# EAGLE design ospi150 (EAGLE 7.7.0)
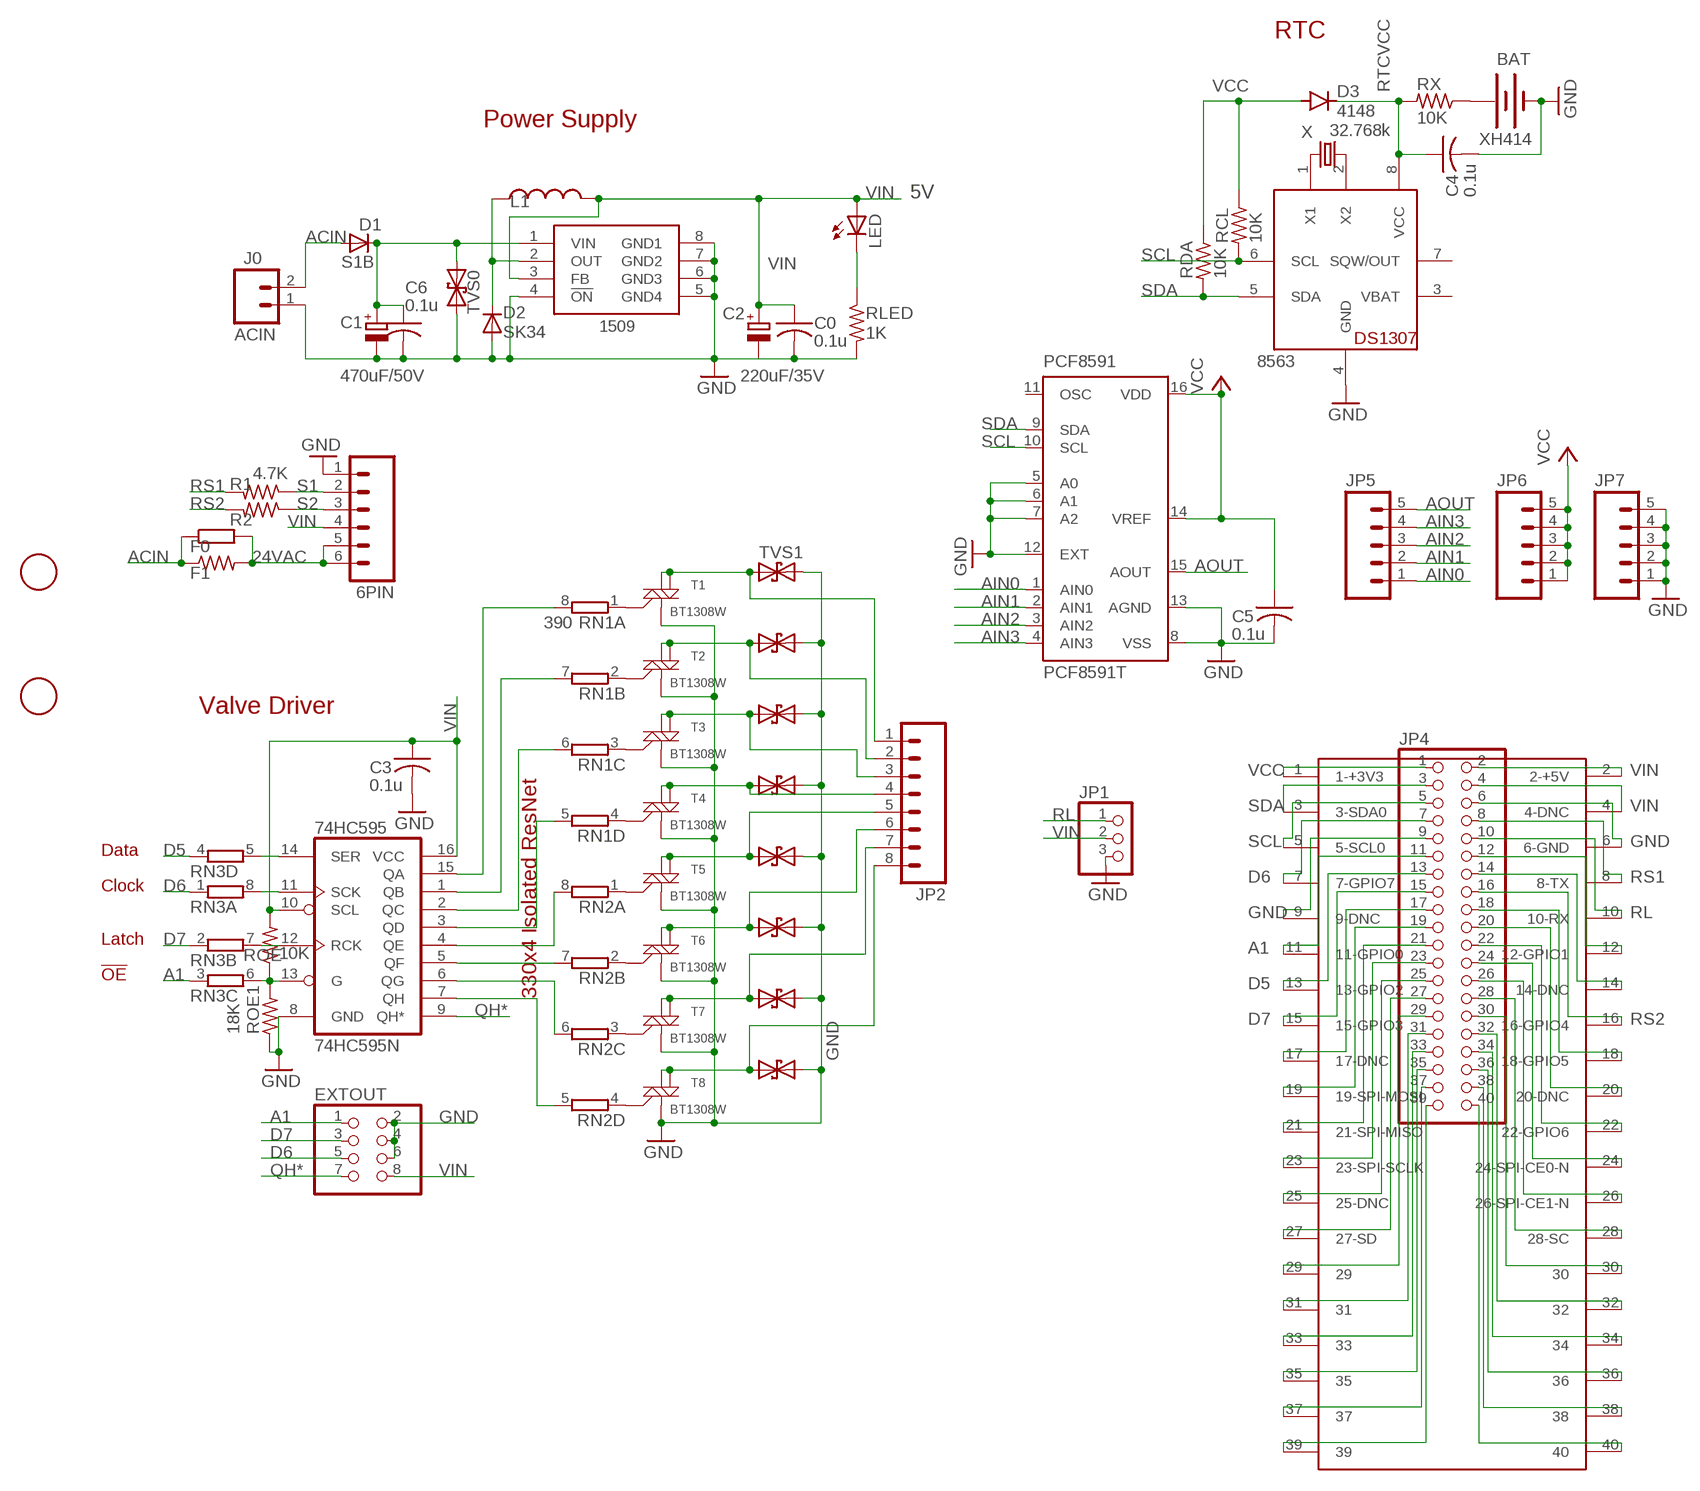
[diagram p0: schematic, sheet 1]

## Parts
1F  FIDUCIAL  [FIDUCIAL_1MM]
2F  FIDUCIAL  [FIDUCIAL_1MM]
6PIN  M065MM  [SCREWTERMINAL-5MM-6]
74HC595  74HC595N  74LS595D  [SO16]
1509  XL1509  [SO08]
8563  PCF8563  DS1307SOIC  [SO08]
BAT  XH414  BATTERYXH414  [BATTCON_XH414]
C0  0.1u  C-USC0603K  [C0603K]
C1  470uF/50V  CPOL-EUE5-10.5  [E5-10,5]
C2  220uF/35V  CPOL-EUE3.5-8  [E3,5-8]
C3  0.1u  C-USC0603K  [C0603K]
C4  0.1u  C-USC0603K  [C0603K]
C5  0.1u  C-USC0603K  [C0603K]
C6  0.1u  C-USC0603K  [C0603K]
D1  S1B  DIODE-DO-214AC  [DO-214AC]
D2  SK34  DIODE-SMB  [SMB]
D3  4148  DIODE-MINIMELF  [MINIMELF]
EXTOUT  PINHD-2X4/90  [2X04/90]
F0  R-EU_0207/15  [0207/15]
F1  R-US_R1206  [R1206]
J0  ACIN  M024MM-X  [SCREWTERMINAL-4MM-2-X]
JP1  PINHD-1X3  [1X03]
JP2  M085MM-8  [SCREWTERMINAL-5MM-8]
JP4  PINHD-2X20  [2X20]
JP5  M05PTH  [1X05]
JP6  M05PTH  [1X05]
JP7  M05PTH  [1X05]
L1  150uH  INDUCTORPWR  [CDRH125]
LED  LEDCHIPLED_0805  [CHIPLED_0805]
PCF8591  PCF8591T  [SO16W]
R1  4.7K  R-US_R0603  [R0603]
R2  4.7K  R-US_R0603  [R0603]
RCL  10K  R-US_R0603  [R0603]
RDA  10K  R-US_R0603  [R0603]
RLED  1K  R-US_R0603  [R0603]
RN1  390  4R-NEXB38V  [EXB38V]
RN2  390  4R-NEXB38V  [EXB38V]
RN3  390  4R-NEXB38V  [EXB38V]
ROE  10K  R-US_R0603  [R0603]
ROE1  18K  R-US_R0603  [R0603]
RX  10K  R-US_R0603  [R0603]
T1  BT1308W  MAC97SOT223  [SOT223]
T2  BT1308W  MAC97SOT223  [SOT223]
T3  BT1308W  MAC97SOT223  [SOT223]
T4  BT1308W  MAC97SOT223  [SOT223]
T5  BT1308W  MAC97SOT223  [SOT223]
T6  BT1308W  MAC97SOT223  [SOT223]
T7  BT1308W  MAC97SOT223  [SOT223]
T8  BT1308W  MAC97SOT223  [SOT223]
TVS0  TVSSMB  [SMB]
TVS1  TVSSMB  [SMB]
TVS2  TVSSMB  [SMB]
TVS3  TVSSMB  [SMB]
TVS4  TVSSMB  [SMB]
TVS5  TVSSMB  [SMB]
TVS6  TVSSMB  [SMB]
TVS7  TVSSMB  [SMB]
TVS8  TVSSMB  [SMB]
U$2  RPIB+B+  [RPIB+]
X  32.768k  CRYSTALMM20SS1  [MM20SS1]

## Nets
24VAC [power]: 6PIN.5 6PIN.6 F0.2 F1.2
A1: EXTOUT.1 JP4.11 RN3.3 U$2.11(11-GPIO0)
ACIN [power]: D1.A F0.1 F1.1 J0.2
AIN0: JP5.1 PCF8591.1(AIN0)
AIN1: JP5.2 PCF8591.2(AIN1)
AIN2: JP5.3 PCF8591.3(AIN2)
AIN3: JP5.4 PCF8591.4(AIN3)
AOUT: JP5.5 PCF8591.15(AOUT)
D5: JP4.13 RN3.4 U$2.13(13-GPIO2)
D6: EXTOUT.5 JP4.7 RN3.1 U$2.7(7-GPIO7)
D7: EXTOUT.3 JP4.15 RN3.2 U$2.15(15-GPIO3)
GND [power]: 6PIN.1 74HC595.8(GND) 1509.4(!ON) 1509.5(GND4) 1509.6(GND3) 1509.7(GND2) 1509.8(GND1) 8563.4(GND) BAT.P$1(-) C0.2 C1.- C2.- C3.2 C4.2 C5.2 C6.2 D2.A EXTOUT.2 EXTOUT.4 EXTOUT.6 J0.1 JP1.3 JP4.6 JP4.9 JP7.1 JP7.2 JP7.3 JP7.4 JP7.5 PCF8591.5(A0) PCF8591.6(A1) PCF8591.7(A2) PCF8591.8(VSS) PCF8591.12(EXT) PCF8591.13(AGND) RLED.2 ROE1.1 T1.1(M1) T2.1(M1) T3.1(M1) T4.1(M1) T5.1(M1) T6.1(M1) T7.1(M1) T8.1(M1) TVS0.A TVS1.C TVS2.C TVS3.C TVS4.C TVS5.C TVS6.C TVS7.C TVS8.C U$2.6(6-GND) U$2.9(9-DNC)
N$1: LED.C RLED.1
N$2 [power]: 1509.1(VIN) C1.+ C6.1 D1.C TVS0.C
N$3: RN1.1 T1.3(G)
N$4: 74HC595.5(QF) RN2.7
N$5: 74HC595.6(QG) RN2.6
N$6: RN1.2 T2.3(G)
N$7: 74HC595.7(QH) RN2.5
N$8 [power]: JP2.2 T2.2(M2) T2.4(M2-4) TVS2.A
N$9: 8563.2(X2) X.4
N$10: 74HC595.4(QE) RN2.8
N$11: 74HC595.3(QD) RN1.5
N$12: 74HC595.2(QC) RN1.6
N$13: 74HC595.1(QB) RN1.7
N$14: 74HC595.15(QA) RN1.8
N$15: RN1.3 T3.3(G)
N$16 [power]: JP2.1 T1.2(M2) T1.4(M2-4) TVS1.A
N$18 [power]: JP2.3 T3.2(M2) T3.4(M2-4) TVS3.A
N$19: RN1.4 T4.3(G)
N$20 [power]: JP2.4 T4.2(M2) T4.4(M2-4) TVS4.A
N$21: RN2.1 T5.3(G)
N$22 [power]: JP2.5 T5.2(M2) T5.4(M2-4) TVS5.A
N$23 [power]: JP2.6 T6.2(M2) T6.4(M2-4) TVS6.A
N$25 [power]: JP2.7 T7.2(M2) T7.4(M2-4) TVS7.A
N$26: RN2.2 T6.3(G)
N$27: RN2.3 T7.3(G)
N$28: RN2.4 T8.3(G)
N$30: 8563.1(X1) X.1
N$32: BAT.P$2(+) RX.1
N$33: 74HC595.14(SER) RN3.5
N$34: 74HC595.11(SCK) RN3.8
N$35: 74HC595.12(RCK) RN3.7
N$36: 1509.2(OUT) D2.C L1.1
N$37: JP4.12 U$2.12(12-GPIO1)
N$38: JP4.14 U$2.14(14-DNC)
N$40: 74HC595.13(G) RN3.6 ROE1.2 ROE.1
N$41: JP4.23 U$2.23(23-SPI-SCLK)
N$42: JP4.25 U$2.25(25-DNC)
N$43: JP4.27 U$2.27(27-SD)
N$44: JP4.29 U$2.29
N$45: JP4.39 U$2.39
N$46: JP4.37 U$2.37
N$47: JP4.17 U$2.17(17-DNC)
N$48: JP4.19 U$2.19(19-SPI-MOSI)
N$49: JP4.21 U$2.21(21-SPI-MISO)
N$50: JP4.35 U$2.35
N$51: JP4.33 U$2.33
N$52: JP4.31 U$2.31
N$53: JP4.34 U$2.34
N$54: JP4.36 U$2.36
N$55: JP4.38 U$2.38
N$56: JP4.40 U$2.40
N$57 [power]: JP2.8 T8.2(M2) T8.4(M2-4) TVS8.A
N$59: JP4.18 U$2.18(18-GPIO5)
N$60: JP4.20 U$2.20(20-DNC)
N$61: JP4.22 U$2.22(22-GPIO6)
N$62: JP4.24 U$2.24(24-SPI-CE0-N)
N$63: JP4.26 U$2.26(26-SPI-CE1-N)
N$64: JP4.28 U$2.28(28-SC)
N$65: JP4.30 U$2.30
N$66: JP4.32 U$2.32
QH*: 74HC595.9(QH*) EXTOUT.7
RL: JP1.1 JP4.10 U$2.10(10-RX)
RS1: JP4.8 R1.2 U$2.8(8-TX)
RS2: JP4.16 R2.2 U$2.16(16-GPIO4)
RTCVCC [power]: 8563.8(VCC) C4.1 D3.C RX.2
S1: 6PIN.2 R1.1
S2: 6PIN.3 R2.1
SCL [i2c]: 8563.6(SCL) JP4.5 PCF8591.10(SCL) RCL.2 U$2.5(5-SCL0)
SDA [i2c]: 8563.5(SDA) JP4.3 PCF8591.9(SDA) RDA.2 U$2.3(3-SDA0)
VCC: C5.1 D3.A JP4.1 JP6.1 JP6.2 JP6.3 JP6.4 JP6.5 PCF8591.14(VREF) PCF8591.16(VDD) RCL.1 RDA.1 U$2.1(1-+3V3)
VIN [power]: 6PIN.4 74HC595.10(SCL) 74HC595.16(VCC) 1509.3(FB) C0.1 C2.+ C3.1 EXTOUT.8 JP1.2 JP4.2 JP4.4 L1.2 LED.A ROE.2 U$2.2(2-+5V) U$2.4(4-DNC)
Unconnected: 8563.7(SQW/OUT) PCF8591.11(OSC)

## Notes on the sheet
- RTC
- Power Supply
- 5V
- Valve Driver
- Data
- Clock
- Latch
- !OE
- 330x4 Isolated ResNet

## Power pins joined to a net without a drawn wire
VBAT: 8563.3(VBAT)

## Library data of the parts
1F 2F = adafruitGood:FIDUCIAL: For use by pick and place machines to calibrate the vision/machine, 1mm By microbuilder.eu
6PIN = SparkFun:M06: Header 6 Standard 6-pin 0.1" header. Use with straight break away headers (SKU : PRT-00116), right angle break away headers (PRT-00553), swiss pins (PRT-00743), machine pins (PRT-00117), and female headers (PRT-00115). Molex polarized connector foot print use with SKU : PRT-08094 with associated crimp pins and housings. NOTES ON THE VARIANTS LOCK and LOCK_LONGPADS... This footprint was designed to help hold the alignment of a through-hole component (i.e. 6-pin header) while soldering it into place. You may notice that each hole has been shifted either up or down by 0.005 of an inch from it's more standard position (which is a perfectly straight line). This slight alteration caused the pins (the squares in the middle) to touch the edges of the holes. Because they are alternating, it causes a "brace" to hold the component in place. 0.005 has proven to be the perfect amount of "off-center" position when using our standard breakaway headers. Although looks a little odd when you look at the bare footprint, once you have a header in there, the alteration is very hard to notice. Also, if you push a header all the way into place, it is covered up entirely on the bottom side. This idea of altering the position of holes to aid alignment will be further integrated into the Sparkfun Library for other footprints. It can help hold any component with 3 or more connection pins.
74HC595 = SparkFun:74*595: 8-bit SHIFT REGISTER, output latch
1509 = adafruit:XL1509
8563 = adafruit:DS1307: DS1307 Real time clock (RTC) with battery backup ability. Talk to it via i2c
BAT = SparkFunNew:BATTERY: Battery Holders Various common sizes : AA, AAA, 20mm coin cell and 12mm coin cell.
C0 C3-C6 = adafruit:C-US: CAPACITOR, American symbol
C1 C2 = resistor:CPOL-EU: POLARIZED CAPACITOR, European symbol
D1 D2 = diode:DIODE-: DIODE
D3 = diode@1:DIODE-: DIODE
EXTOUT = pinhead:PINHD-2X4: PIN HEADER
F0 = rcl:R-EU_: RESISTOR, European symbol; SPICEPREFIX: R
F1 = adafruit:R-US_: RESISTOR, American symbol
J0 = SparkFun:M02: Header 2 Standard 2-pin 0.1" header. Use with straight break away headers (SKU : PRT-00116), right angle break away headers (PRT-00553), swiss pins (PRT-00743), machine pins (PRT-00117), and female headers (PRT-00115). Molex polarized connector foot print use with SKU : PRT-08233 with associated crimp pins and housings.
JP1 = pinhead:PINHD-1X3: PIN HEADER
JP2 = SparkFun:M08: Header 8 Standard 8-pin 0.1" header. Use with straight break away headers (SKU : PRT-00116), right angle break away headers (PRT-00553), swiss pins (PRT-00743), machine pins (PRT-00117), and female headers (PRT-00115).
JP4 = adafruit_3:PINHD-2X20: PIN HEADER
JP5-JP7 = SparkFun:M05: Header 5 Standard 5-pin 0.1" header. Use with straight break away headers (SKU : PRT-00116), right angle break away headers (PRT-00553), swiss pins (PRT-00743), machine pins (PRT-00117), and female headers (PRT-00115). Molex polarized connector foot print use with SKU : PRT-08230 with associated crimp pins and housings.
L1 = SparkFunNew:INDUCTOR: Inductors Basic Inductor/Choke - 0603 and 1206. Footprints are not proven and vary greatly between part numbers.
LED = adafruit:LED: LED OSRAM: - CHIPLED LG R971, LG N971, LY N971, LG Q971, LY Q971, LO R971, LY R971 LH N974, LH R974 LS Q976, LO Q976, LY Q976 LO Q996 - Hyper CHIPLED LW Q18S LB Q993, LB Q99A, LB R99A - SideLED LS A670, LO A670, LY A670, LG A670, LP A670 LB A673, LV A673, LT A673, LW A673 LH A674 LY A675 LS A676, LA A676, LO A676, LY A676, LW A676 LS A679, LY A679, LG A679 - Hyper Micro SIDELED® LS Y876, LA Y876, LO Y876, LY Y876 LT Y87S - SmartLED LW L88C, LW L88S LB L89C, LB L89S, LG L890 LS L89K, LO L89K, LY L89K LS L896, LA L896, LO L896, LY L896 - TOPLED LS T670, LO T670, LY T670, LG T670, LP T670 LSG T670, LSP T670, LSY T670, LOP T670, LYG T670 LG T671, LOG T671, LSG T671 LB T673, LV T673, LT T673, LW T673 LH T674 LS T676, LA T676, LO T676, LY T676, LB T676, LH T676, LSB T676, LW T676 LB T67C, LV T67C, LT T67C, LS T67K, LO T67K, LY T67K, LW E67C LS E67B, LA E67B, LO E67B, LY E67B, LB E67C, LV E67C, LT E67C LW T67C LS T679, LY T679, LG T679 LS T770, LO T770, LY T770, LG T770, LP T770 LB T773, LV T773, LT T773, LW T773 LH T774 LS E675, LA E675, LY E675, LS T675 LS T776, LA T776, LO T776, LY T776, LB T776 LHGB T686 LT T68C, LB T68C - Hyper Mini TOPLED® LB M676 - Mini TOPLED Santana® LG M470 LS M47K, LO M47K, LY M47K Source: http://www.osram.convergy.de/
PCF8591 = micro-philips:PCF8591: I2C-Bus D/A CONVERTER; MPN: PCF8591T/2,512; OC_FARNELL: 1826767; OC_NEWARK: 70R6911
R1 R2 RCL RDA RLED ROE ROE1 RX = adafruit2013:R-US_: RESISTOR, American symbol
RN1-RN3 = resistor-dil:4R-N: Array Chip Resistor Source: RS Component / Phycomp; OC_FARNELL: unknown; OC_NEWARK: unknown
T1-T8 = SparkFun:MAC97: MAC97 Triac http://www.onsemi.com/pub_link/Collateral/MAC97-D.PDF
TVS0 TVS1-TVS8 = SparkFunNew:TVS
U$2 = RaspberryPi:RPIB+
X = crystal:CRYSTAL: CRYSTAL

## Net classes
0 default: width 0.178 mm, clearance 0.178 mm
1 power: width 0.254 mm, clearance 0.203 mm
2 relay power: width 0.508 mm, clearance 0.254 mm
3 i2c: width 0.254 mm, clearance 0.203 mm

## Board
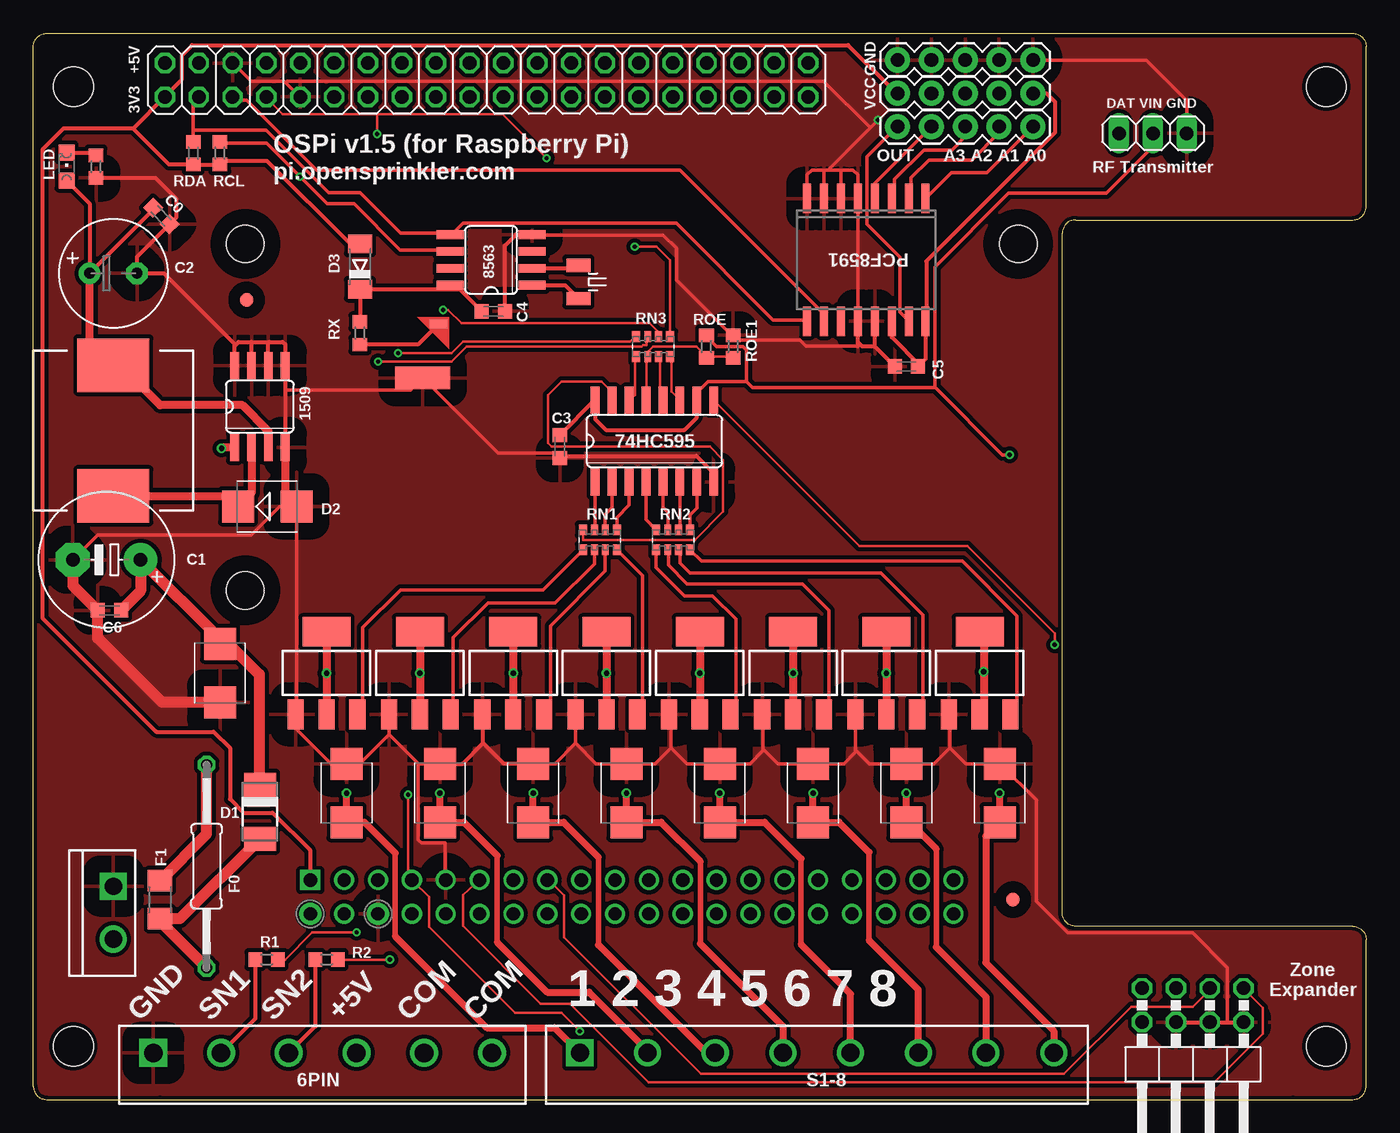
[diagram p1: board, top side]
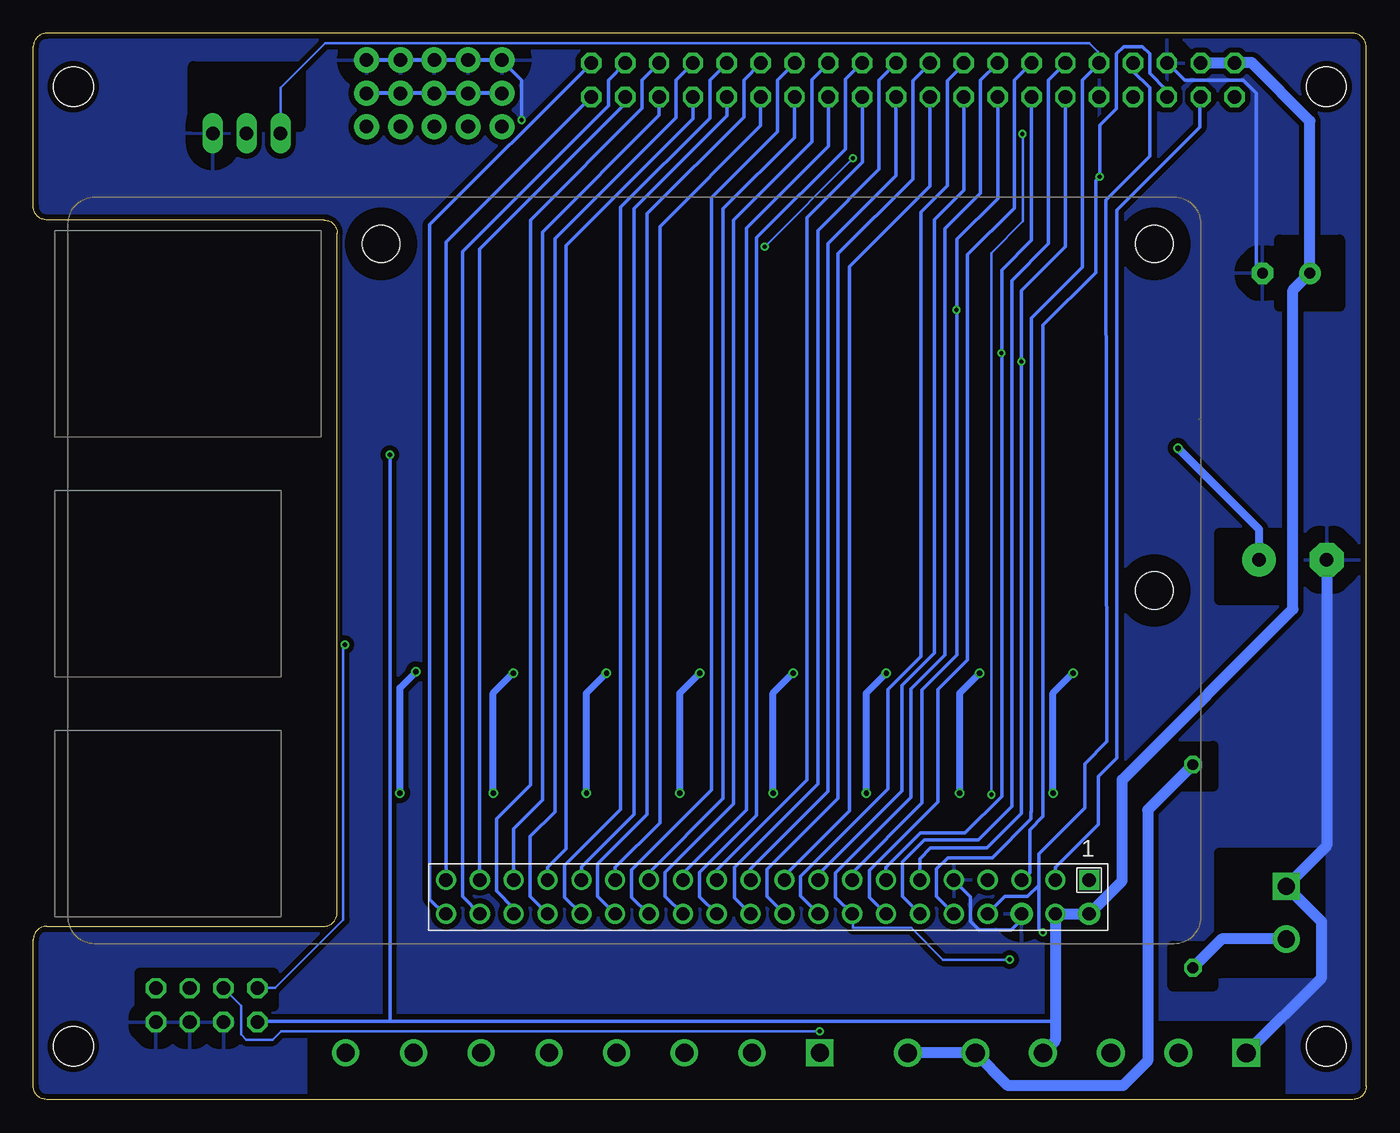
[diagram p2: board, bottom side, seen from below]

Size 100 x 80 mm. Coordinates in mm from the lower left corner, seen from the top.
Outline: 9.5,0 94.5,0 99,0 arc90 100,1 100,12 arc90 99,13 78.2,13 arc-90 77.2,14 77.2,65 arc-90 78.2,66 99,66 arc90 100,67 100,79 arc90 99,80 1,80 arc90 0,79 0,1 arc90 1,0 9.5,0
Copper layers (1*16): Top 0.035mm / dielectric 1.5mm / Bottom 0.035mm
Design rules "Fusion_eagle_rule_v1.1 *": minimum track width 6mil, minimum drill 12mil, track to track 6mil, track to pad 6mil, pad to pad 6mil, via to via 6mil, smd to smd 0mil, copper to edge 10mil, drill to drill 10mil, minimum pad ring 10mil, minimum via ring 6mil, stop-mask expansion 2mil, vias tented up to drill 100mil, thermal gap 50mil
Holes 3 mm at 3,76 97,76 3,4 97,4
tRestrict: area 71.6,61.9 to 76.2,66.5; area 13.6,61.9 to 18.2,66.5; area 13.6,35.9 to 18.2,40.5
bRestrict: area 13.6,61.9 to 18.2,66.5; area 71.6,61.9 to 76.2,66.5; area 2,59.5 to 6.5,64.5; area 5.5,37.5 to 11,42.5; area 3.5,9.5 to 11,18.5; area 11.5,23.5 to 14.5,26.5; area 11.5,8.5 to 14.5,11.5; area 6.5,0.5 to 79,5.5; area 80,73 to 88,77.5; area 82,7 to 92,9.5; area 13.6,35.9 to 18.2,40.5

### Footprints (pad centres in the part's own frame; a part is rotated, then mirrored left to right if it is on the bottom)
FIDUCIAL_1MM = smd 1 x 1: 1 0,0
SCREWTERMINAL-5MM-6 = drill 1.4 pad 2.032 square: 1 0,0 | drill 1.4 pad 2.032: 2 5.08,0; 3 10.16,0; 4 15.24,0; 5 20.32,0; 6 25.4,0
SO16 = smd 0.66 x 2.032: 1 -4.445,-3.073; 2 -3.175,-3.073; 3 -1.905,-3.073; 4 -0.635,-3.073; 5 0.635,-3.073; 6 1.905,-3.073; 7 3.175,-3.073; 8 4.445,-3.073; 9 4.445,3.073; 10 3.175,3.073; 11 1.905,3.073; 12 0.635,3.073; 13 -0.635,3.073; 14 -1.905,3.073; 15 -3.175,3.073; 16 -4.445,3.073
SO08 = smd 0.66 x 2.032: 1 -1.905,-3.073; 2 -0.635,-3.073; 3 0.635,-3.073; 4 1.905,-3.073; 5 1.905,3.073; 6 0.635,3.073; 7 -0.635,3.073; 8 -1.905,3.073
BATTCON_XH414 = smd 4.1 x 1.7: P$1 0.7,-1.85 | smd 1.27 x 0.635: P$2 1.9,2.2
C0603K = smd 1.05 x 1.08: 1 -0.875,0; 2 0.875,0
E5-10,5 = drill 1.016 pad 2.54: + -2.54,0 | drill 1.016 pad 2.54 octagon: - 2.54,0
E3,5-8 = drill 0.813 pad 1.6: + -1.778,0 | drill 0.813 pad 1.6 octagon: - 1.778,0
DO-214AC = smd 1.8 x 2.4: A 2.025,0; C -2.025,0
SMB = smd 2.4 x 2.4: A 2.2,0; C -2.2,0
MINIMELF = smd 1.4 x 1.8: A 1.7,0; C -1.7,0
2X04/90 = drill 1.016 octagon: 1 -3.81,-6.35; 2 -3.81,-3.81; 3 -1.27,-6.35; 4 -1.27,-3.81; 5 1.27,-6.35; 6 1.27,-3.81; 7 3.81,-6.35; 8 3.81,-3.81
0207/15 = drill 0.813 octagon: 1 -7.62,0; 2 7.62,0
R1206 = smd 1.6 x 1.803: 1 -1.422,0; 2 1.422,0
SCREWTERMINAL-4MM-2-X = drill 1.3 pad 2.032 square: 1 0,0 | drill 1.3 pad 2.032: 2 3.96,0
1X03 = drill 1.016 long: 1 -2.54,0; 2 0,0; 3 2.54,0
SCREWTERMINAL-5MM-8 = drill 1.35 pad 2.032 square: 1 0,0 | drill 1.35 pad 2.032: 2 5.08,0; 3 10.16,0; 4 15.24,0; 5 20.32,0; 6 25.4,0; 7 30.48,0; 8 35.56,0
2X20 = drill 1.016 octagon: 1 -24.13,-1.27; 2 -24.13,1.27; 3 -21.59,-1.27; 4 -21.59,1.27; 5 -19.05,-1.27; 6 -19.05,1.27; 7 -16.51,-1.27; 8 -16.51,1.27; 9 -13.97,-1.27; 10 -13.97,1.27; 11 -11.43,-1.27; 12 -11.43,1.27; 13 -8.89,-1.27; 14 -8.89,1.27; 15 -6.35,-1.27; 16 -6.35,1.27; 17 -3.81,-1.27; 18 -3.81,1.27; 19 -1.27,-1.27; 20 -1.27,1.27; 21 1.27,-1.27; 22 1.27,1.27; 23 3.81,-1.27; 24 3.81,1.27; 25 6.35,-1.27; 26 6.35,1.27; 27 8.89,-1.27; 28 8.89,1.27; 29 11.43,-1.27; 30 11.43,1.27; 31 13.97,-1.27; 32 13.97,1.27; 33 16.51,-1.27; 34 16.51,1.27; 35 19.05,-1.27; 36 19.05,1.27; 37 21.59,-1.27; 38 21.59,1.27; 39 24.13,-1.27; 40 24.13,1.27
1X05 = drill 1.016 pad 1.88: 1 0,0; 2 2.54,0; 3 5.08,0; 4 7.62,0; 5 10.16,0
CDRH125 = smd 5.4 x 4: 1 0,4.9; 2 0,-4.9
CHIPLED_0805 = smd 1.2 x 1.2: A 0,-1.05; C 0,1.05
SO16W = smd 0.6 x 2.2: 1 -4.445,-4.6; 2 -3.175,-4.6; 3 -1.905,-4.6; 4 -0.635,-4.6; 5 0.635,-4.6; 6 1.905,-4.6; 7 3.175,-4.6; 8 4.445,-4.6; 9 4.445,4.6; 10 3.175,4.6; 11 1.905,4.6; 12 0.635,4.6; 13 -0.635,4.6; 14 -1.905,4.6; 15 -3.175,4.6; 16 -4.445,4.6
R0603 = smd 1 x 1.1: 1 -0.85,0; 2 0.85,0
EXB38V = smd 0.6 x 0.8: 1 -1.275,-0.75; 4 1.275,-0.75; 5 1.275,0.75; 8 -1.275,0.75 | smd 0.5 x 0.8: 2 -0.4,-0.75; 3 0.4,-0.75; 6 0.4,0.75; 7 -0.4,0.75
SOT223 = smd 1.219 x 2.235: 1 -2.311,-3.099; 2 0,-3.099; 3 2.311,-3.099 | smd 3.6 x 2.2: 4 0,3.099
RPIB+ = drill 1 square: 1 8.382,51.232 | drill 1 pad 1.676: 2 8.382,53.772; 6 13.462,53.772 | drill 1: 3 10.922,51.232; 4 10.922,53.772; 5 13.462,51.232; 7 16.002,51.232; 8 16.002,53.772; 9 18.542,51.232; 10 18.542,53.772; 11 21.082,51.232; 12 21.082,53.772; 13 23.622,51.232; 14 23.622,53.772; 15 26.162,51.232; 16 26.162,53.772; 17 28.702,51.232; 18 28.702,53.772; 19 31.242,51.232; 20 31.242,53.772; 21 33.782,51.232; 22 33.782,53.772; 23 36.322,51.232; 24 36.322,53.772; 25 38.862,51.232; 26 38.862,53.772; 27 41.402,51.232; 28 41.402,53.772; 29 43.942,51.232; 30 43.942,53.772; 31 46.482,51.232; 32 46.482,53.772; 33 49.022,51.232; 34 49.022,53.772; 35 51.562,51.232; 36 51.562,53.772; 37 54.102,51.232; 38 54.102,53.772; 39 56.642,51.232; 40 56.642,53.772 | hole 2.8: 3.5,3.5; 61.5,3.5; 3.5,29.5
MM20SS1 = smd 1.8 x 1: 1 0,-1.25; 4 0,1.25

### Placement (x,y rotation side)
1F  16,60 0 top
2F  73.5,15 0 top
6PIN  9,3.5 0 top
74HC595  46.6,49.4 0 top
1509  17,52 0 top
8563  34.35,63 90 top
BAT  28.5,56 0 top
C0  9.6,66.3 315 top
C1  5.5,40.5 180 top
C2  6,62 0 top
C3  39.5,49 270 top
C4  34.5,59.15 0 top
C5  65.5,55 180 top
C6  5.7,36.7 180 top
D1  17,21.6 270 top
D2  17.55,44.5 0 top
D3  24.5,62.5 90 top
EXTOUT  87,2 180 top
F0  13,17.5 90 top
F1  9.5,15 90 top
J0  6,16 270 top
JP1  84,72.5 0 top
JP2  41,3.5 0 top
JP4  34,76.5 0 top
JP5  75,73 180 top
JP6  75,75.5 180 top
JP7  75,78 180 top
L1  6,50.2 180 top
LED  2.5,70 0 top
PCF8591  62.5,63 180 top
R1  17.5,10.5 0 top
R2  22,10.5 0 top
RCL  14,71 90 top
RDA  12,71 90 top
RLED  4.7,70 270 top
RN1  42.5,42 0 top
RN2  48,42 0 top
RN3  46.5,56.5 180 top
ROE  50.5,56.5 90 top
ROE1  52.5,56.5 270 top
RX  24.5,57.5 90 top
T1  22,32 0 top
T2  29,32 0 top
T3  36,32 0 top
T4  43,32 0 top
T5  50,32 0 top
T6  57,32 0 top
T7  64,32 0 top
T8  71,32 0 top
TVS0  14,32 270 top
TVS1  23.5,23 270 top
TVS2  30.5,23 270 top
TVS3  37.5,23 270 top
TVS4  44.5,23 270 top
TVS5  51.5,23 270 top
TVS6  58.5,23 270 top
TVS7  65.5,23 270 top
TVS8  72.5,23 270 top
U$2  12.4,67.7 180 bottom
X  40.9,61.35 0 top

### Tracks (layer width: path | path; a pad name or v marks a point on that pad's centre or on a via)
24VAC
  Top 0.813: F1.2 13,19.92 F0.2
  Bottom 0.813: 6PIN.6 6PIN.5 26.87,1.05 18.25,1.05 16.4,2.9 16.4,21.72 F0.2
A1  (via drill 0.3)
  Top 0.178: v25.88,55.38 31.38,55.38 32.5,56.5 45.62,56.5 45.75,56.62 46,56.62 46,57.25 RN3.3 | EXTOUT.1 90.88,8.25 92.25,6.88 92.25,4.95 88.6,1.3 46.15,1.3 40.25,7.2 38.05,7.2 32.23,13.03 32.23,15.37 U$2.11
  Bottom 0.178: v25.88,55.38 25.87,55.38
  Bottom 0.254: JP4.11 22.57,63.98 25.87,60.68 25.87,55.38 25.87,21.47 28.47,18.87 32.68,18.87 33.48,18.07 U$2.11
ACIN
  Top 0.813: F0.1 9.5,13.38 F1.1 11,13.58 D1.A
  Bottom 0.813: J0.2 10.84,12.04 F0.1
AIN0
  Top 0.254: PCF8591.1 68.89,69.55 71.55,69.55 JP5.1
AIN1
  Top 0.254: PCF8591.2 65.85,67.78 65.85,69.15 67.2,70.5 70.4,70.5 72.46,72.56 JP5.2
AIN2
  Top 0.254: PCF8591.3 64.6,67.8 64.6,69.05 66.8,71.25 68.9,71.25 69.92,72.27 JP5.3
AIN3
  Top 0.254: PCF8591.4 63.13,68.75 JP5.4
AOUT
  Top 0.254: PCF8591.15 65.01,59.06 65.01,63.19 62.53,65.67 62.53,70.73 64.8,73 JP5.5
D5  (via drill 0.3)
  Top 0.178: v27.38,56 31.38,56 32.25,56.88 44.75,56.88 45.12,57.25 RN3.4
  Bottom 0.178: v27.38,56 27.35,56
  Bottom 0.254: JP4.13 25.11,64.49 27.35,62.25 27.35,56 27.35,22.75 30.1,20 33.45,20 36.02,17.43 U$2.13
D6  (via drill 0.3)
  Top 0.178: v45.12,64 46.75,64 47.75,63 47.75,57.25 RN3.1 | v38.5,70.62 35.2,73.92 25.8,73.92 | 25.8,73.92 18.7,73.92 17.5,75.12 JP4.7 | v41,5.12 39.62,6.5 36.15,6.5 29.68,12.97 29.68,15.2 28.5,16.38 U$2.7 28.38,16.5 28.12,16.5 v28.12,22.88 | v25.8,72.45 25.8,73.92
  Bottom 0.178: v38.5,70.62 v45.12,64 | v41,5.12 81.42,5.12 82.05,4.5 84.04,4.5 84.42,4.88 84.42,7.05 85.62,8.25 EXTOUT.5 | v25.8,72.45 25.75,72.4 25.75,65.9 28.12,63.52 v28.12,22.88
D7  (via drill 0.3)
  Top 0.178: v30.75,59.25 31.12,59.25 32.12,58.25 46.24,58.25 46.88,57.62 46.88,57.25 RN3.2 | EXTOUT.3 88.25,8.25 86.97,6.97 82.38,6.97 77.33,1.93 50.08,1.93 39.83,12.18 39.83,15.3 38.66,16.47 U$2.15
  Bottom 0.178: v30.75,59.25 30.7,59.25
  Bottom 0.254: JP4.15 27.65,67.6 30.7,64.55 30.7,59.25 30.7,33.35 33.32,30.73 33.32,22.25 38.56,17 U$2.15
GND  (via drill 0.3)
  Top 0.254: PCF8591.12 PCF8591.5 61.87,69.39 61.5,69.75 60.65,69.75 | PCF8591.8 58.05,69.41 58.4,69.75 59.35,69.75 | 59.35,69.75 59.75,69.75 | 59.75,69.75 60.65,69.75 | PCF8591.7 59.33,69.72 59.35,69.75 | PCF8591.6 60.59,69.69 60.65,69.75 | TVS2.C 28.9,25.2 | 26.69,27.41 T2.1 | 28.9,25.2 26.69,27.41 | 26.69,27.41 24.48,25.2 TVS1.C 22.35,25.2 19.69,27.86 T1.1 19.75,29 D2.A 18.48,44.5 16.35,42.38 4.83,42.38 C1.- | TVS3.C 39.15,25.2 40.69,26.74 | 40.69,26.74 T4.1 | 40.69,26.74 42.23,25.2 TVS4.C 46.65,25.2 47.85,26.4 | 47.85,26.4 47.85,28.15 47.88,28.25 47.88,28.88 47.75,28.88 T5.1 | 47.85,26.4 49.05,25.2 TVS5.C 53.75,25.2 54.75,26.2 54.75,26.3 | 54.75,26.3 54.75,28.84 T6.1 | 54.75,26.3 55.85,25.2 TVS6.C 60.8,25.2 61.69,26.09 61.69,26.25 | 61.69,26.25 T7.1 | 61.69,26.25 62.74,25.2 TVS7.C 67.55,25.2 68.75,26.4 | 68.75,26.4 68.75,28.88 T8.1 | 68.75,26.4 69.95,25.2 TVS8.C 72.5,25.12 72.6,25.12 75.25,22.48 75.25,14.88 77.62,12.5 86.97,12.5 89.58,9.9 89.58,5.81 | U$2.9 30.88,16.5 30.88,19.25 29.12,19.25 28.88,19.5 28.88,25.12 28.9,25.2 | JP7.1 83.5,78 86.54,74.96 JP1.3 | 61.87,56.52 57.98,56.52 57.5,57 52.75,57 52.5,57.25 ROE1.1 52.38,57.38 48.25,61.5 48.25,63.88 47.25,64.88 37.5,64.88 8563.4 | 62.79,72.91 59.75,69.88 59.75,69.75 | 62.79,72.91 v63.38,73.5 | 18.94,76.31 18.82,76.42 16.32,76.42 15,77.75 JP4.6 | 18.94,76.31 20,75.25 JP4.9 | 18.91,53.25 28.3,53.25 BAT.P$1 29.25,54.12 34.88,48.5 39,48.5 39.38,48.12 C3.2 | 62.79,72.91 59.27,76.42 19.05,76.42 18.94,76.31
  Top 0.305: 1509.8 15.1,56.55 | 15.1,56.55 15.4,56.85 16.35,56.85 | 16.35,56.85 17.7,56.85 | 17.7,56.85 18.7,56.85 18.91,56.65 1509.5 | 1509.5 18.91,53.25 | 1509.7 16.36,56.84 16.35,56.85 | 1509.6 17.64,56.78 17.7,56.85 | 1509.5 1509.4 | 15.1,56.55 15.1,56.68 9.78,62 C2.- 7.78,63.24 C0.2 10.7,66.16 10.7,67.6 9.15,69.15 RLED.2 | EXTOUT.6 EXTOUT.4 89.58,5.81 EXTOUT.2 | C4.2 35.38,64.08 36.2,64.91 8563.4 | C5.2 63.13,56.49 | 63.13,56.49 PCF8591.13 | 63.13,56.49 63.12,56.5 62.2,56.5 61.87,56.84 | 61.87,56.52 61.87,56.84 | 61.87,56.84 PCF8591.12 | C3.2 39.67,48.3 49.75,48.3 51.05,47.01 74HC595.8 | TVS2.C 32.2,25.2 33.75,26.75 | 33.75,26.75 33.75,28.84 T3.1 | TVS3.C 35.3,25.2 33.75,26.75
  Top 0.61: 1509.4 18.91,45.34 D2.A
  Top 0.813: C1.- 2.96,38.56 C6.2 4.83,34.62 9.65,29.8 TVS0.A
  Bottom 0.254: U$2.9 30.88,16.38 29.7,15.2 29.7,13.38 29.07,12.75 26.62,12.75 25.88,13.5 25.88,13.88 U$2.6 | v63.38,73.5 63.38,76.5 64.75,77.88 JP7.5 | JP4.6 14.88,77.75 13.6,76.47 9.23,76.47 8.25,75.49 8.25,62.38 7.88,62 C2.-
  Bottom 0.305: JP7.5 JP7.4 JP7.3 JP7.2 JP7.1
  Bottom 0.813: 6PIN.1 3.35,9.15 3.35,13.35 J0.1 2.96,19.04 C1.-
  pour Top (isolate 0.305): 0,80 100,80 100,0 0,0
  pour Bottom (isolate 0.406): 0,80 100,80 100,0 0,0
N$1
  Top 0.305: LED.C 4.5,71.05 RLED.1
N$2  (via drill 0.4)
  Top 0.61: 1509.1 14.13,48.93 14.1,48.9 v14.12,48.88
  Top 0.813: D1.C 16.95,23.68 16.95,31.9 14.65,34.2 TVS0.C 14,34.54 C1.+ 8.04,38.16 C6.1
  Bottom 0.61: v14.12,48.88 8.04,42.79 C1.+
N$3
  Top 0.254: RN1.1 38.23,38.25 27.55,38.25 24.71,35.41 24.71,29.3 T1.3
N$4
  Top 0.254: 74HC595.5 47.23,44.41 47.6,44.05 RN2.7
N$5
  Top 0.254: 74HC595.6 48.51,42.85 RN2.6
N$6
  Top 0.254: RN1.2 42.1,40.2 39.15,37.25 34.1,37.25 31.51,34.66 31.51,29.1 T2.3
N$7
  Top 0.254: 74HC595.7 49.77,44.38 49.27,43.88 RN2.5
N$8  (via drill 0.4)
  Top 0.406: 34.8,18.31 34.8,11.8
  Top 0.508: 34.8,18.31 32.31,20.8 TVS2.A v30.5,23 | 34.8,11.8 38.55,8.05 41.7,8.05 46.08,3.67 JP2.2
  Top 0.61: T2.4 v29,32 T2.2
  Bottom 0.508: v30.5,23 30.5,30.5 v29,32
N$9
  Top 0.305: 8563.2 40.66,62.37 X.4
N$10
  Top 0.254: 74HC595.4 45.97,43.51 RN2.8
N$11
  Top 0.254: 74HC595.3 44.7,44.59 43.77,43.67 RN1.5
N$12
  Top 0.254: 74HC595.2 43.42,44.42 42.9,43.9 RN1.6
N$13
  Top 0.254: 74HC595.1 42.16,42.8 RN1.7
N$14
  Top 0.178: RN1.8 41.25,42.75 41.25,42 49.62,42 51.75,44.12 51.75,48 50.75,49 38.88,49 38.62,49.25 38.62,52.88 39.62,53.88 42.62,53.88 43.38,53.12 43.38,52.5 74HC595.15
N$15
  Top 0.254: RN1.3 42.9,39.65 38.8,35.55 38.8,29.39 T3.3
N$16  (via drill 0.4)
  Top 0.406: 27.16,18.49 27.16,12.26
  Top 0.508: 27.16,18.49 24.85,20.8 TVS1.A v23.5,23 | 27.16,12.26 34.02,5.4 39.1,5.4 JP2.1
  Top 0.61: T1.4 v22,32 T1.2
  Bottom 0.508: v23.5,23 23.5,30.5 v22,32
N$18  (via drill 0.4)
  Top 0.406: 42.4,18.18 42.4,11.6
  Top 0.508: 42.4,18.18 39.78,20.8 TVS3.A v37.5,23 | 42.4,11.6 50.5,3.5 JP2.3
  Top 0.61: T3.4 v36,32 T3.2
  Bottom 0.508: v37.5,23 37.5,30.5 v36,32
N$19
  Top 0.254: RN1.4 45.7,39.33 45.7,29.29 T4.3
N$20  (via drill 0.4)
  Top 0.406: 50.05,17.85 50.05,11.69
  Top 0.508: 50.05,17.85 47.1,20.8 TVS4.A v44.5,23 | 50.05,11.69 56.24,5.5 JP2.4
  Top 0.61: T4.4 v43,32 T4.2
  Bottom 0.508: v44.5,23 44.5,30.5 v43,32
N$21
  Top 0.254: RN2.1 46.73,39.92 48.85,37.8 50.95,37.8 52.7,36.05 52.7,29.1 52.5,28.9 T5.3
N$22  (via drill 0.4)
  Top 0.406: 57.6,18.07 57.6,11.65
  Top 0.508: 57.6,18.07 54.87,20.8 TVS5.A v51.5,23 | JP2.5 61.32,7.93 57.6,11.65
  Top 0.61: T5.4 v50,32 T5.2
  Bottom 0.508: v51.5,23 51.5,30.5 v50,32
N$23  (via drill 0.4)
  Top 0.406: 62.7,18.55 62.7,11.95
  Top 0.508: 62.7,18.55 60.45,20.8 TVS6.A v58.5,23 | JP2.6 66.4,8.25 62.7,11.95
  Top 0.61: T6.4 v57,32 T6.2
  Bottom 0.508: v58.5,23 58.5,30.5 v57,32
N$25  (via drill 0.4)
  Top 0.406: 67.75,18.8 67.75,11.43
  Top 0.508: 67.75,18.8 65.75,20.8 TVS7.A v65.5,23 | 67.75,11.43 71.48,7.7 JP2.7
  Top 0.61: T7.4 v64,32 T7.2
  Bottom 0.508: v65.5,23 65.5,30.5 v64,32
N$26
  Top 0.254: RN2.2 47.65,41.2 47.65,40.1 49.05,38.7 57.7,38.7 59.7,36.7 59.7,29.4 59.31,29.01 T6.3
N$27
  Top 0.254: RN2.3 48.5,41.15 48.5,40.25 49.25,39.5 63.6,39.5 66.75,36.35 66.75,29.75 66.31,29.31 T7.3
N$28
  Top 0.254: RN2.4 50.12,40.4 69.7,40.4 73.8,36.3 73.8,29.8 73.31,29.31 T8.3
N$30
  Top 0.305: 8563.1 39.91,61.09 X.1
N$32
  Top 0.305: BAT.P$2 28.85,56.65 RX.1
N$33
  Top 0.178: RN3.5 45.12,55.75 45.12,52.88 44.75,52.5 74HC595.14
N$34
  Top 0.178: RN3.8 47.88,55.75 47.88,53.12 48.5,52.5 74HC595.11
N$35
  Top 0.178: RN3.7 47,55.75 47,52.5 47.12,52.5 74HC595.12
N$36
  Top 0.61: 1509.2 16.36,45.52 D2.C 14.55,45.3 L1.1
N$37
  Bottom 0.254: JP4.12 23.85,76.49 23.85,64.2 26.6,61.45 26.6,22 29.1,19.5 33.15,19.5 34.8,17.85 34.8,15.25 U$2.12
N$38
  Bottom 0.254: JP4.14 26.41,76.47 26.41,66.87 29.9,63.38 29.9,33 32.12,30.78 32.12,22.33 37.27,17.18 37.27,15.18 U$2.14
N$40
  Top 0.178: 50.5,55.75 52.5,55.75 ROE1.2 | 74HC595.13 46,52.5 46,55.75 RN3.6 46.12,55.75 46.12,56.12 46.5,56.5 49.75,56.5 50.5,55.75 | 50.5,55.75 ROE.1
N$41
  Bottom 0.254: JP4.23 37.81,70.33 41.96,66.18 41.96,23.98 48.72,17.22 U$2.23
N$42
  Bottom 0.254: JP4.25 40.35,71.53 46.5,65.38 46.5,21.73 51.26,16.97 U$2.25
N$43
  Bottom 0.254: JP4.27 42.89,72.18 48.24,66.83 48.24,22.58 53.8,17.02 U$2.27
N$44
  Bottom 0.254: JP4.29 45.43,73.07 53,65.5 53,20.76 56.34,17.42 U$2.29
N$45
  Bottom 0.254: U$2.39 69.04,64.32 JP4.39
N$46
  Bottom 0.254: U$2.37 66.5,63.82 55.59,74.73 JP4.37
N$47
  Bottom 0.254: JP4.17 30.19,68.23 32.39,66.03 32.39,33.51 34.84,31.07 34.84,23.15 41.1,16.89 U$2.17
N$48
  Bottom 0.254: JP4.19 32.73,68.53 38.78,62.48 38.78,21.66 43.64,16.79 U$2.19
N$49
  Bottom 0.254: JP4.21 35.27,69.33 40.37,64.23 40.37,23.13 46.18,17.32 U$2.21
N$50
  Bottom 0.254: JP4.35 53.05,73.85 61.8,65.1 61.8,22.48 63.96,20.32 U$2.35
N$51
  Bottom 0.254: U$2.33 61.42,17.42 60.03,18.81 60.03,64.08 50.51,73.59 JP4.33
N$52
  Bottom 0.254: U$2.31 58.88,17.47 54.94,21.41 54.94,66.85 47.97,73.82 JP4.31
N$53
  Bottom 0.254: U$2.34 62.72,15.23 62.72,19.73 60.85,21.6 60.85,64.6 51.78,73.68 51.78,76.5 JP4.34
N$54
  Bottom 0.254: JP4.36 54.32,76.5 54.32,74.36 62.69,65.99 62.69,23.61 65.25,21.05 65.25,15.65 63.96,14.36 U$2.36
N$55
  Bottom 0.254: U$2.38 67.81,15.24 67.81,63.61 56.86,74.56 56.86,76.5 JP4.38
N$56
  Bottom 0.254: U$2.40 69.14,13.93 70.25,15.04 70.25,65.65 JP4.40
N$57  (via drill 0.4)
  Top 0.508: JP2.8 76.56,5.15 71.45,10.26 71.45,19.75 TVS8.A v72.5,23
  Top 0.61: T8.4 71.3,34.8 v71.3,32.1 71.3,29.2 T8.2
  Bottom 0.508: v72.5,23 72.5,30.9 v71.3,32.1
N$59
  Bottom 0.254: JP4.18 30.19,77.67 31.42,76.44 31.42,68.58 33.4,66.6 33.4,33.25 35.89,30.76 35.89,23.31 42.45,16.75 42.45,15.28 U$2.18
N$60
  Bottom 0.254: JP4.20 32.73,77.74 34.01,76.45 34.01,69.07 39.63,63.45 39.63,22.59 44.94,17.28 44.94,15.23 U$2.20
N$61
  Bottom 0.254: JP4.22 36.55,76.49 36.55,69.79 41.14,65.2 41.14,23.67 47.38,17.43 47.38,15.13 U$2.22
N$62
  Bottom 0.254: JP4.24 37.86,77.77 39.08,76.55 39.08,71.32 45.75,64.65 45.75,21.31 50.01,17.04 50.01,15.22 U$2.24
N$63
  Bottom 0.254: JP4.26 41.6,76.52 41.6,71.87 47.47,66 47.47,22.16 52.59,17.04 52.59,15.26 U$2.26
N$64
  Bottom 0.254: JP4.28 44.17,76.49 44.17,72.61 49.11,67.67 49.11,23.22 55.1,17.23 55.1,15.18 53.85,13.93 U$2.28
N$65
  Bottom 0.254: U$2.30 57.65,15.24 57.65,17.67 53.94,21.38 53.94,66.47 46.7,73.72 46.7,76.5 JP4.30
N$66
  Bottom 0.254: U$2.32 60.14,15.19 60.14,17.58 55.93,21.79 55.93,66.95 49.24,73.64 49.24,76.5 JP4.32
QH*  (via drill 0.3)
  Top 0.178: v76.62,34.12 76.62,34.98 70.08,41.52 61.98,41.52 51.12,52.38 74HC595.9
  Bottom 0.178: v76.62,34.12 76.75,34 76.75,13.5 81.88,8.38 83.12,8.38 EXTOUT.7
RL
  Bottom 0.178: JP1.1 81.46,75.92 78.12,79.25 20.76,79.25 20.12,78.61 20.12,77.88 JP4.10
  Bottom 0.254: JP4.10 21.3,76.5 21.3,62.45 25.14,58.61 25.14,21.59 25.15,21.58 25.15,21.05 28.05,18.15 31.4,18.15 32.25,17.3 32.25,15.24 U$2.10
RS1  (via drill 0.3)
  Top 0.178: v24.25,12.55 20.93,12.55 18.88,10.5 R1.2
  Bottom 0.254: JP4.8 17.49,77.17 16.22,75.9 16.22,70.8 19.52,67.5 19.44,26.86 21.1,25.2 21.1,21.9 24.56,18.44 24.56,16.07 | 24.56,16.07 25.41,15.23 27.1,15.23 U$2.8 | v24.25,12.55 24.56,12.86 24.56,16.07
RS2  (via drill 0.3)
  Top 0.178: v26.75,10.5 R2.2
  Bottom 0.178: v26.75,10.5 31.75,10.5 34.12,12.88 38.5,12.88 38.5,13.88 U$2.16
  Bottom 0.254: JP4.16 28.95,76.47 28.95,68 31.6,65.35 31.6,33.35 34.15,30.8 34.15,22.67 39.82,17.01 39.82,15.19 U$2.16
RTCVCC
  Top 0.305: C4.1 31.98,60.8 | 31.98,60.8 31.68,61.09 8563.8 | RX.2 D3.C 31.98,60.8
S1
  Top 0.305: R1.1 16.65,6.07 6PIN.2
S2
  Top 0.305: R2.1 21.15,5.49 6PIN.3
SCL  (via drill 0.3)
  Top 0.254: RCL.2 14,71.75 17.5,71.75 v20,69.25 22.05,67.2 24.05,67.2 27.5,63.75 31.25,63.75 8563.6 | PCF8591.10 59.25,58.5 59.25,59 48.5,69.75 21.25,69.75 16,75 15,75 JP4.5
  Bottom 0.254: U$2.5 25.75,16.5 25.25,17 25.25,20.25 24.25,21.25 24.25,58.1 20.3,62.05 20.3,68.95 v20,69.25 20,73.1 18.75,74.35 18.75,78.45 18.2,79 16.8,79 16.25,78.45 16.25,77 15,75.75 15,75.25 JP4.5
SDA
  Top 0.254: 12,72.75 12,74.75 12.25,75 JP4.3 | 12,72.75 RDA.2 | 12,72.75 17.45,72.75 22.15,68.05 24.5,68.05 27.55,65 31.25,65 8563.5 31.5,65 32.25,65.75 48.25,65.75 55.5,58.5 58,58.5 PCF8591.9
  Bottom 0.254: U$2.3 23.32,17.43 20.1,20.65 20.1,24.25 18.7,25.65 18.7,66.75 12.5,72.95 12.5,75 JP4.3
VCC
  Top 0.178: 67,58.5 PCF8591.16 | 20.75,16.5 U$2.1 | 9.96,75.38 9.88,75.38 JP4.1 | 64.75,75.5 JP6.5
  Top 0.305: PCF8591.16 66.94,55.57 66.49,55.11 | 66.49,55.11 C5.1 | PCF8591.14 64.41,57.2 66.49,55.11 | JP4.1 7.49,72.85 | 67,58.5 67,62.9 76.65,72.55 76.65,74.86 76.02,75.5 JP6.1 | D3.A 23.75,64.2 17.52,70.42 14.28,70.42 RCL.1 RDA.1 10.19,70.15 7.49,72.85 | 20.75,16.5 20.75,18.73 17.95,21.52 15.78,21.52 14.75,22.55 14.75,26.36 13.52,27.6 9.22,27.6 0.68,36.15 0.68,71.27 2.26,72.85 7.49,72.85 | 64.75,75.5 61.12,79.12 11.9,79.12 11.15,78.38 11.15,76.56 9.96,75.38
  Bottom 0.305: JP6.5 JP6.4 JP6.3 JP6.2 JP6.1
VIN  (via drill 0.3)
  Top 0.254: 53.5,53.88 53.95,53.42 67.62,53.42 67.62,53.45 | 53.5,53.88 53.5,56.25 53.25,56.5 51.25,56.5 50.5,57.25 ROE.2 | 53.5,53.88 50.62,53.88 49.75,53 49.75,52.62 74HC595.10 | JP1.2 84,71.5 80.5,68 73.15,68 67.62,62.48 67.62,53.45 | v73.25,48.38 72.7,48.38 67.62,53.45
  Top 0.305: C0.1 8.98,66.76 C2.+ 4.22,67.23 LED.A | C3.1 42.1,52.47 74HC595.16 42.16,51.05 42.95,50.25 48.85,50.25 49.77,51.17 74HC595.10
  Top 0.61: 1509.3 17.64,50.16 15.7,52.1 9.5,52.1 6.5,55.1 L1.2 4.22,56.88 C2.+
  Bottom 0.254: 23.32,5.88 73.25,5.88 | 73.25,5.88 83.12,5.88 EXTOUT.8 | 73.25,5.88 v73.25,48.38
  Bottom 0.813: 6PIN.4 23.32,4.42 23.32,5.88 U$2.4 U$2.2 18.3,16.41 18.3,24 5.5,36.8 5.5,60.72 C2.+ 4.22,73.42 8.6,77.8 9.84,77.8 JP4.2 JP4.4

### Text on the board
tNames: GND | +5V | VCC | 3V3 | DAT VIN GND | OSPi v1.5 (for Raspberry Pi) | OUT | A3 A2 A1 A0 | RF Transmitter | pi.opensprinkler.com | Zone / Expander | 1 2 3 4 5 6 7 8 | GND | SN1 | SN2 | +5V | COM | COM | 6PIN | S1-8
cache: 1.000000 2.500000 3.000000 16.000000 7.000000 1.600000 10.000000 4.200000 3.000000 2.000000 20.000000 0.100000 3.200000 2 1 2 1 104